# EAGLE schematic Speedy V2.1 (EAGLE 6.6.0)

## Sheet 1 of 4: Power
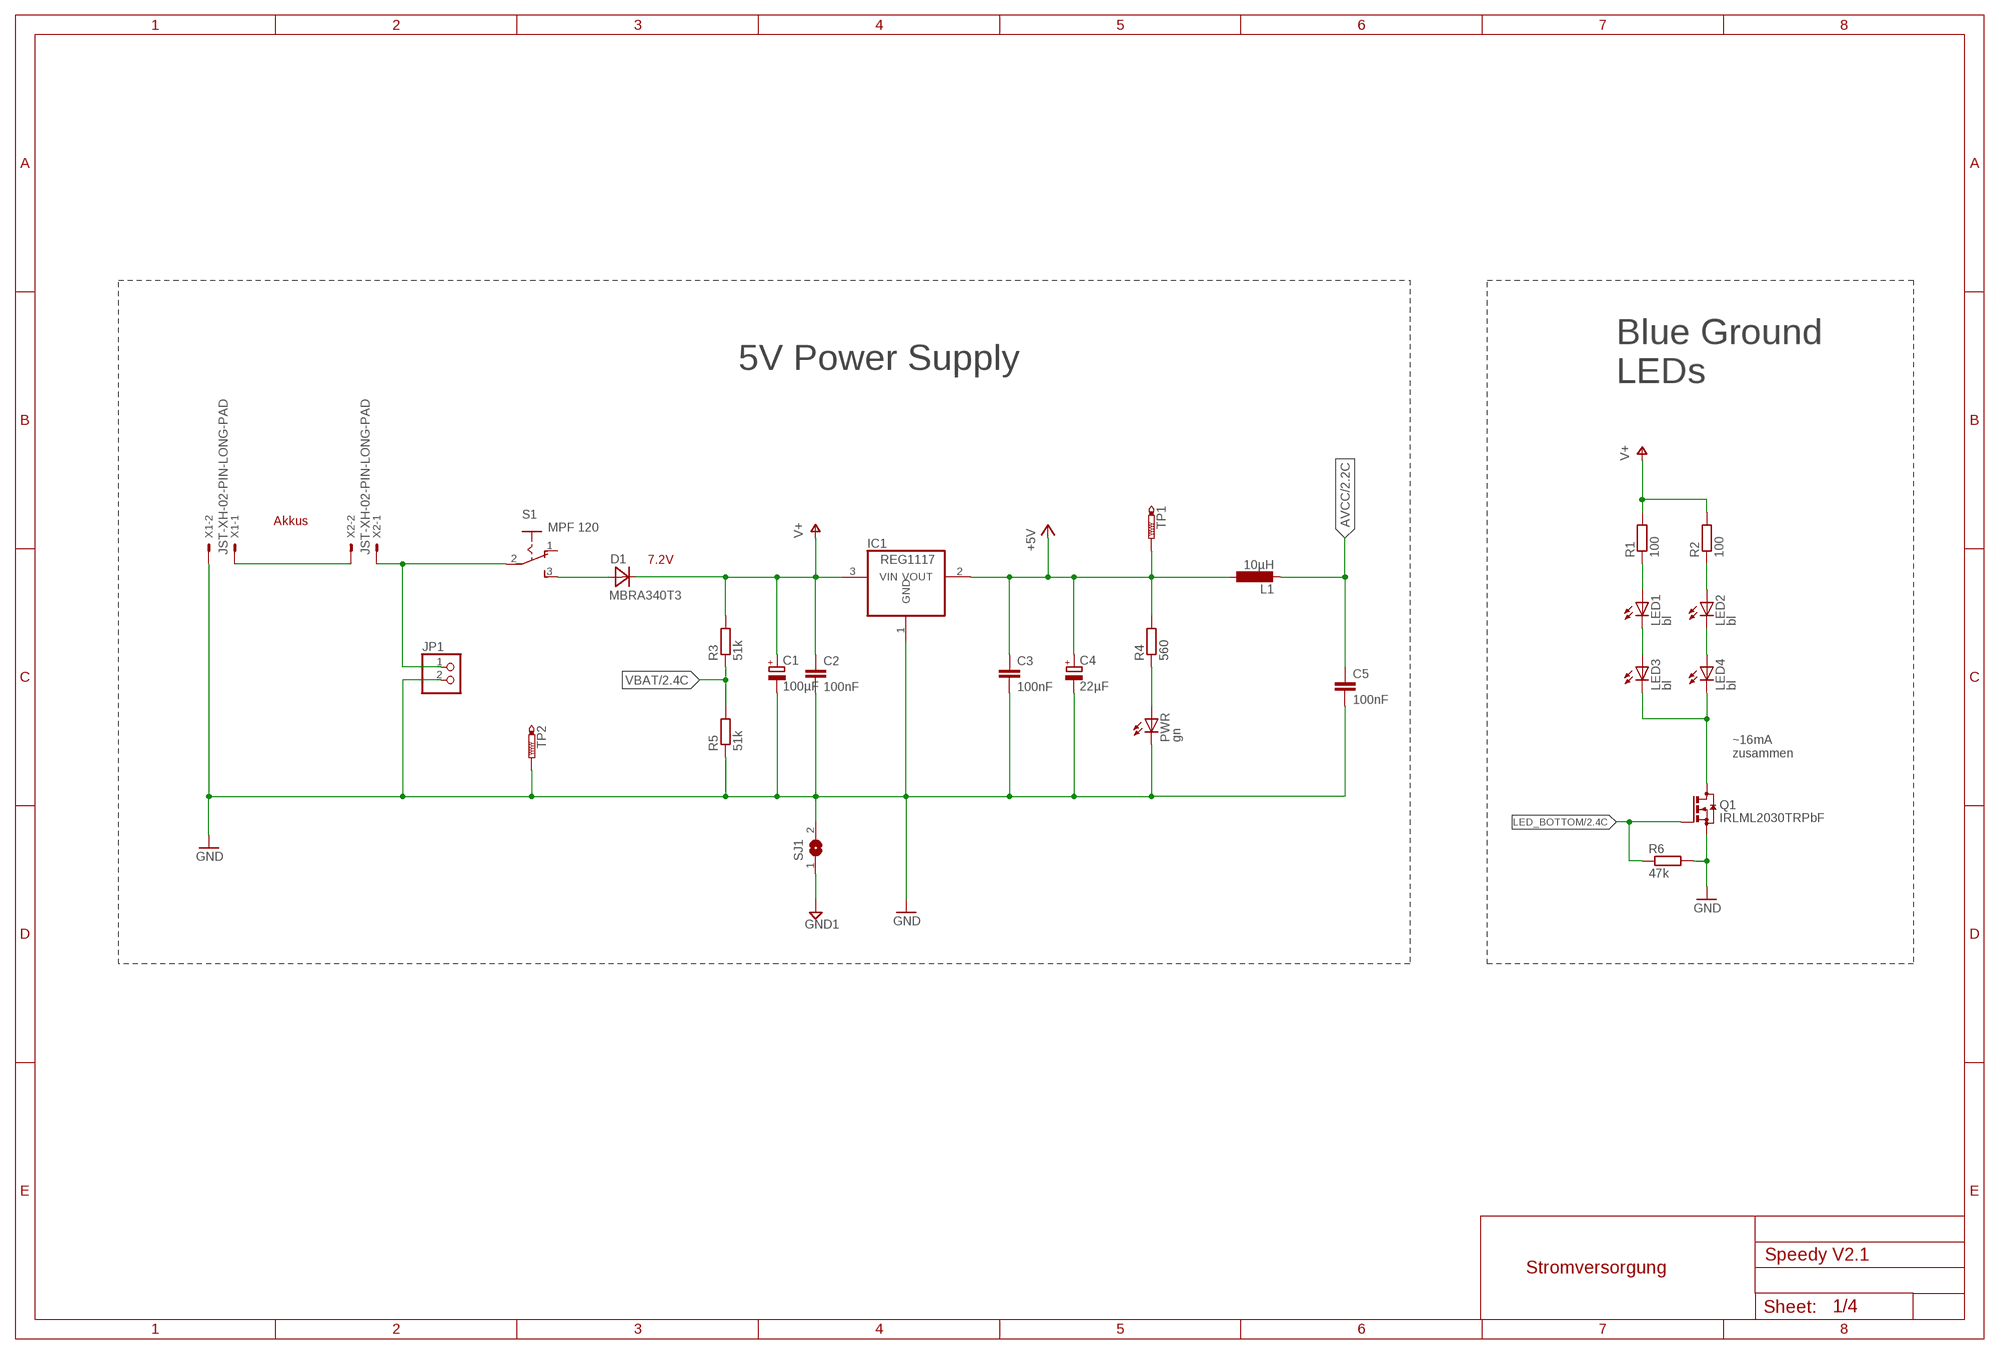
[diagram p0: schematic, sheet 1]

### Parts
C1  100µF  CPOL-EUD  [PANASONIC_D]
C2  100nF  C-EUC0805  [C0805]
C3  100nF  C-EUC0805  [C0805]
C4  22µF  CPOL-EUB  [PANASONIC_B]
C5  100nF  C-EUC0805  [C0805]
D1  MBRA340T3  [SMA]
IC1  REG1117  [SOT223]
JP1  PINHD-1X2  [1X02]
L1  10µH  L-1210  [C1210K]
LED1  bl  LEDCHIPLED_0805  [CHIPLED_0805]
LED2  bl  LEDCHIPLED_0805  [CHIPLED_0805]
LED3  bl  LEDCHIPLED_0805  [CHIPLED_0805]
LED4  bl  LEDCHIPLED_0805  [CHIPLED_0805]
PWR  gn  LEDCHIPLED_0805  [CHIPLED_0805]
Q1  IRLML2030TRPbF  BSS123  [SOT23]
R1  100  R-EU_R0805  [R0805]
R2  100  R-EU_R0805  [R0805]
R3  51k  R-EU_R0805  [R0805]
R4  560  R-EU_R0805  [R0805]
R5  51k  R-EU_R0805  [R0805]
R6  47k  R-EU_R0805  [R0805]
S1  MPF 120  255SB  [255SB]
SJ1  SJ  [SJ]
TP1  PTR1B1,27  [B1,27]
TP2  PTR1PAD1-13  [P1-13]
X1  JST-XH-02-PIN-LONG-PAD  [JST-XH-02-PACKAGE-LONG-PAD]
X2  JST-XH-02-PIN-LONG-PAD  [JST-XH-02-PACKAGE-LONG-PAD]

### Nets
+5V [Supply]: C3.1 C4.+ IC1.2(VOUT) L1.1 R4.2 TP1.TP ; also sheet 2,3,4
AVCC: C5.1 L1.2 ; also sheet 2
GND [Supply]: C1.- C2.2 C3.2 C4.- C5.2 IC1.1(GND) JP1.2 PWR.C Q1.2(S) R5.1 R6.2 SJ1.2 TP2.TP X1.2 ; also sheet 2,3,4
GND1 [Supply]: SJ1.1 ; also sheet 4
LED_BOTTOM: Q1.1(G) R6.1 ; also sheet 2
N$1 [Supply]: X1.1 X2.2
N$3: PWR.A R4.1
N$11: JP1.1 S1.2(P) X2.1
N$13: LED3.C LED4.C Q1.3(D)
N$19: D1.A S1.3(S)
N$29: LED1.A R1.1
N$30: LED1.C LED3.A
N$32: LED2.C LED4.A
N$33: LED2.A R2.1
V+ [Supply]: C1.+ C2.1 D1.C IC1.3(VIN) R1.2 R2.2 R3.2 ; also sheet 2,4
VBAT: R3.1 R5.2 ; also sheet 2
Unconnected: S1.1(O)

### Notes on the sheet
- 5V Power Supply
- Blue Ground 
  LEDs
- Akkus
- 7.2V
- ~16mA
  zusammen
- Stromversorgung

## Sheet 2 of 4: Controller
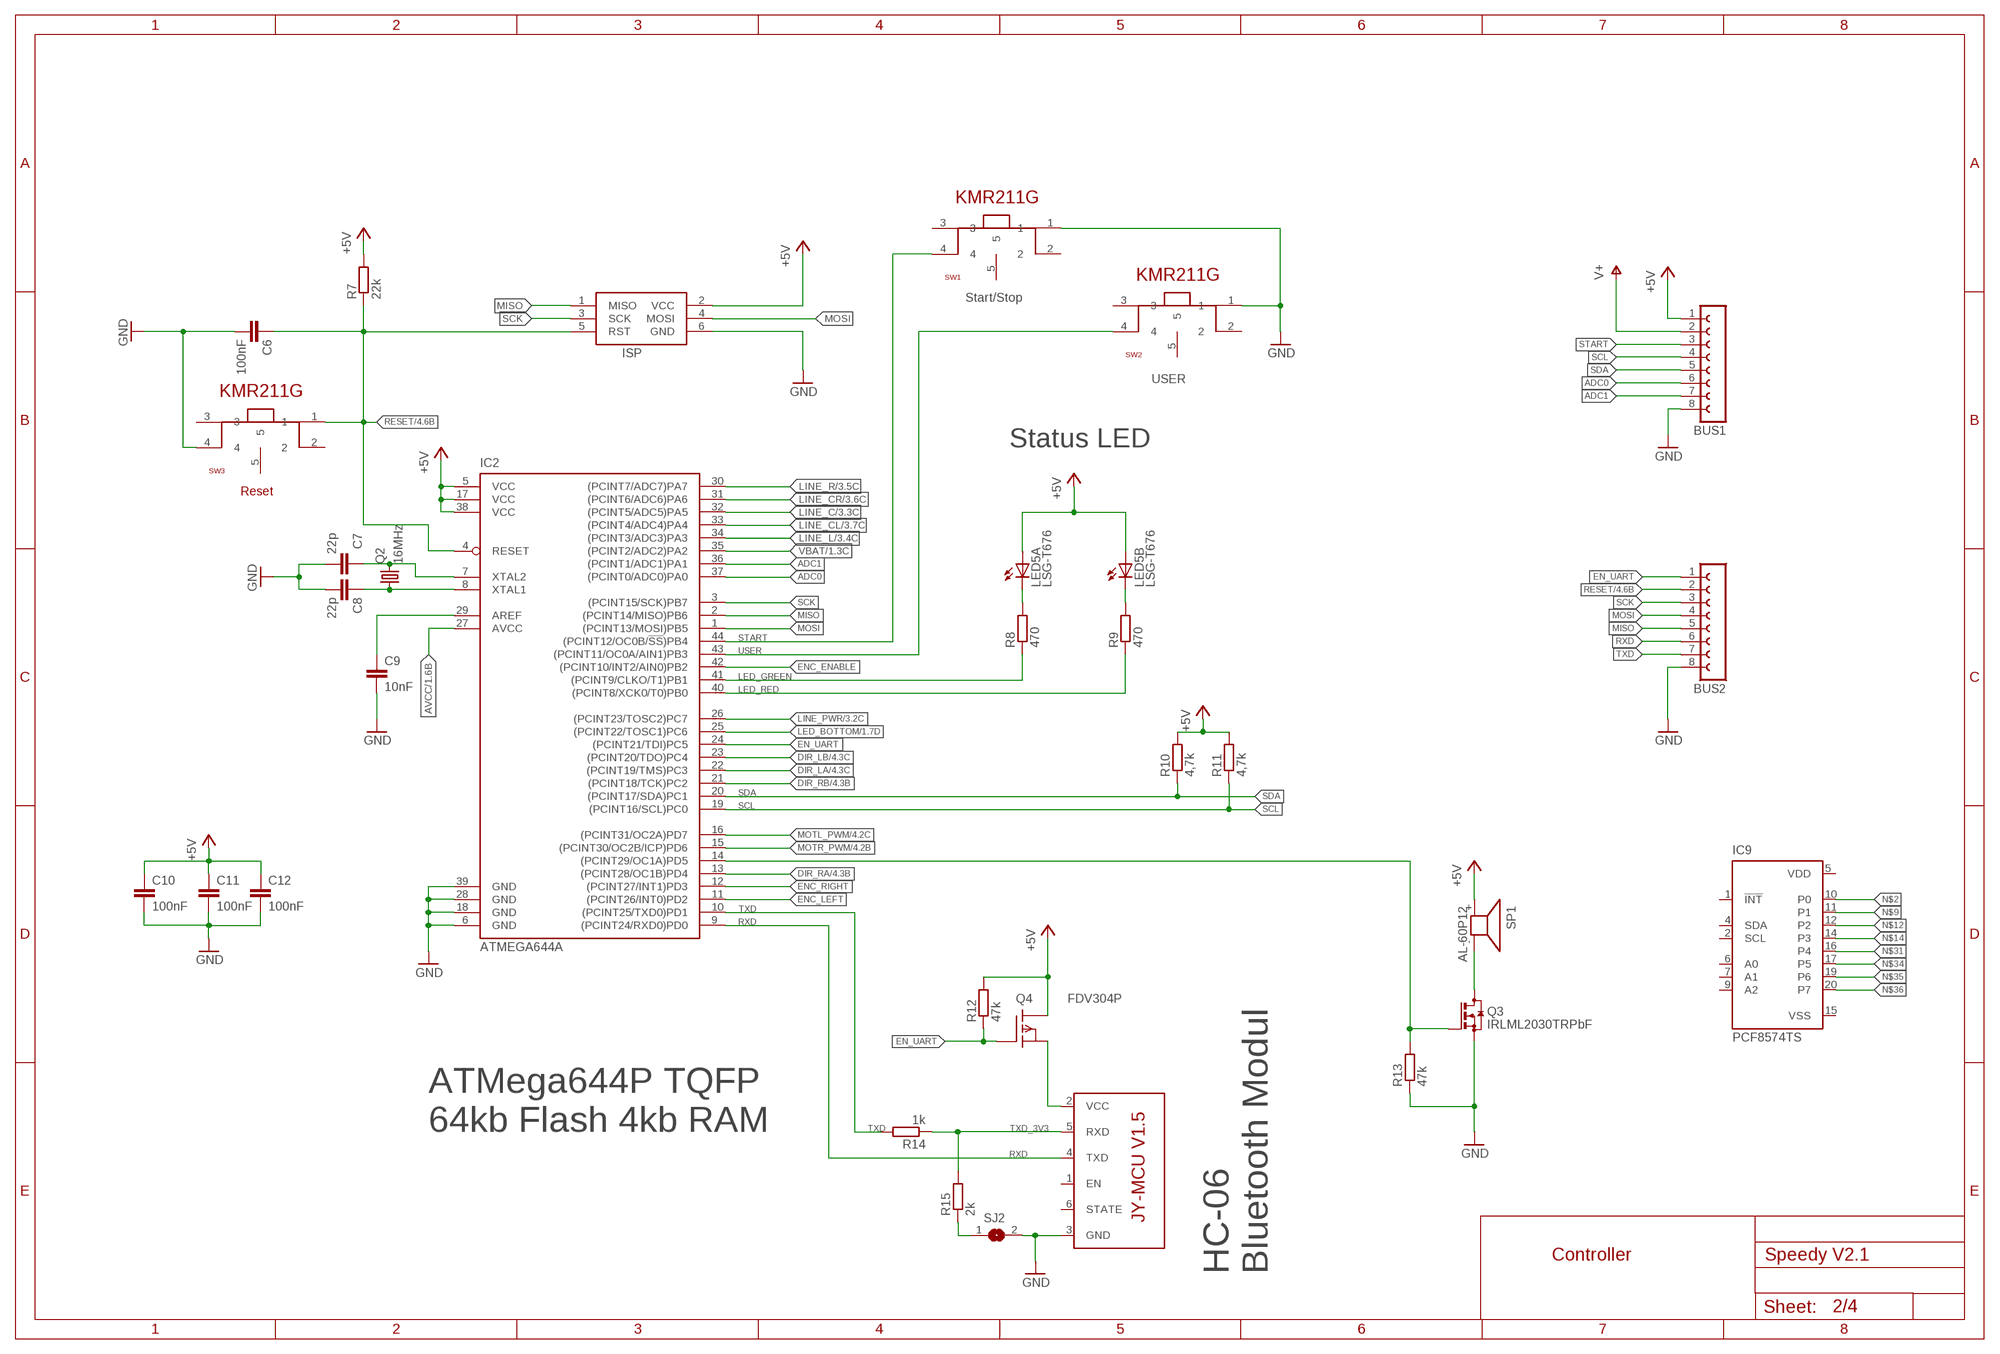
[diagram p1: schematic, sheet 2]

### Parts
BUS1  FE08-1  [FE08]
BUS2  FE08-1  [FE08]
C6  100nF  C-EUC0805  [C0805]
C7  22p  C-EUC0603  [C0603]
C8  22p  C-EUC0603  [C0603]
C9  10nF  C-EUC0603  [C0603]
C10  100nF  C-EUC0603  [C0603]
C11  100nF  C-EUC0603  [C0603]
C12  100nF  C-EUC0603  [C0603]
IC2  ATMEGA644A  [TQFP44]
IC9  PCF8574TS  [SSOP20]
ISP  AVRISP-6  [AVRISP]
LED5  LSG-T676  [P-LCC4-0]
Q2  16MHz  7X5MMMQ  [7X5MMQUARZ]
Q3  IRLML2030TRPbF  BSS123  [SOT23]
Q4  FDV304P  [SOT23]
R7  22k  R-EU_R0805  [R0805]
R8  470  R-EU_R0805  [R0805]
R9  470  R-EU_R0805  [R0805]
R10  4,7k  R-EU_R0805  [R0805]
R11  4,7k  R-EU_R0805  [R0805]
R12  47k  R-EU_R0805  [R0805]
R13  47k  R-EU_R0805  [R0805]
R14  1k  R-EU_R0805  [R0805]
R15  2k  R-EU_R0805  [R0805]
SJ2  SJ  [SJ]
SP1  AL-60P12  KSS1201  [KSS1201]
SW1  KMR211G_SWITCH  [KMR211G_SWITCH]
SW2  KMR211G_SWITCH  [KMR211G_SWITCH]
SW3  KMR211G_SWITCH  [KMR211G_SWITCH]
U1  BT_BOARD  [BT_BOARD]

### Nets
+5V [Supply]: BUS1.1 C10.1 C11.1 C12.1 IC2.5(VCC) IC2.17(VCC) IC2.38(VCC) ISP.2(VCC) LED5.2(A:A) LED5.4(B:A) Q4.D R7.2 R10.2 R11.2 R12.2 SP1.+ ; also sheet 1,3,4
ADC0: BUS1.6 IC2.37((PCINT0/ADC0)PA0)
ADC1: BUS1.7 IC2.36((PCINT1/ADC1)PA1)
AVCC: IC2.27(AVCC) ; also sheet 1
BUZZER: IC2.14((PCINT29/OC1A)PD5) Q3.1(G) R13.2
DIR_LA: IC2.22((PCINT19/TMS)PC3) ; also sheet 4
DIR_LB: IC2.23((PCINT20/TDO)PC4) ; also sheet 4
DIR_RA: IC2.13((PCINT28/OC1B)PD4) ; also sheet 4
DIR_RB: IC2.21((PCINT18/TCK)PC2) ; also sheet 4
EN_UART: BUS2.1 IC2.24((PCINT21/TDI)PC5) Q4.G R12.1
ENC_ENABLE: IC2.42((PCINT10/INT2/AIN0)PB2)
ENC_LEFT: IC2.11((PCINT26/INT0)PD2)
ENC_RIGHT: IC2.12((PCINT27/INT1)PD3)
GND [Supply]: BUS1.8 BUS2.8 C6.2 C7.2 C8.2 C9.2 C10.2 C11.2 C12.2 IC2.6(GND) IC2.18(GND) IC2.28(GND) IC2.39(GND) ISP.6(GND) Q3.2(S) R13.1 SJ2.2 SW1.1 SW2.1 SW3.4 U1.3(GND) ; also sheet 1,3,4
LED_BOTTOM: IC2.25((PCINT22/TOSC1)PC6) ; also sheet 1
LED_GREEN: IC2.41((PCINT9/CLKO/T1)PB1) R8.1
LED_RED: IC2.40((PCINT8/XCK0/T0)PB0) R9.1
LINE_C: IC2.32((PCINT5/ADC5)PA5) ; also sheet 3
LINE_CL: IC2.33((PCINT4/ADC4)PA4) ; also sheet 3
LINE_CR: IC2.31((PCINT6/ADC6)PA6) ; also sheet 3
LINE_L: IC2.34((PCINT3/ADC3)PA3) ; also sheet 3
LINE_PWR: IC2.26((PCINT23/TOSC2)PC7) ; also sheet 3
LINE_R: IC2.30((PCINT7/ADC7)PA7) ; also sheet 3
MISO: BUS2.5 IC2.2((PCINT14/MISO)PB6) ISP.1(MISO)
MOSI: BUS2.4 IC2.1((PCINT13/MOSI)PB5) ISP.4(MOSI)
MOTL_PWM: IC2.16((PCINT31/OC2A)PD7) ; also sheet 4
MOTR_PWM: IC2.15((PCINT30/OC2B/ICP)PD6) ; also sheet 4
N$2: IC9.10(P0)
N$5: Q3.3(D) SP1.-
N$6: LED5.1(A:C) R8.2
N$9: IC9.11(P1)
N$12: IC9.12(P2)
N$14: IC9.14(P3)
N$15: C9.1 IC2.29(AREF)
N$17: R15.1 SJ2.1
N$18: LED5.3(B:C) R9.2
N$20 [Supply]: Q4.S U1.2(VCC)
N$27: C7.1 IC2.7(XTAL2) Q2.P$3
N$28: C8.1 IC2.8(XTAL1) Q2.P$1
N$31: IC9.16(P4)
N$34: IC9.17(P5)
N$35: IC9.19(P6)
N$36: IC9.20(P7)
RESET: BUS2.2 C6.1 IC2.4(RESET) ISP.5(RST) R7.1 SW3.1 ; also sheet 4
RXD: BUS2.6 IC2.9((PCINT24/RXD0)PD0) U1.4(TXD)
SCK: BUS2.3 IC2.3((PCINT15/SCK)PB7) ISP.3(SCK)
SCL: BUS1.4 IC2.19((PCINT16/SCL)PC0) R11.1
SDA: BUS1.5 IC2.20((PCINT17/SDA)PC1) R10.1
START: BUS1.3 IC2.44((PCINT12/OC0B/!SS!)PB4) SW1.4
TXD: BUS2.7 IC2.10((PCINT25/TXD0)PD1) R14.2
TXD_3V3: R14.1 R15.2 U1.5(RXD)
USER: IC2.43((PCINT11/OC0A/AIN1)PB3) SW2.4
V+ [Supply]: BUS1.2 ; also sheet 1,4
VBAT: IC2.35((PCINT2/ADC2)PA2) ; also sheet 1
Unconnected: IC9.1(!INT) IC9.2(SCL) IC9.4(SDA) IC9.6(A0) IC9.7(A1) IC9.9(A2) SW1.2 SW1.3 SW1.5 SW2.2 SW2.3 SW2.5 SW3.2 SW3.3 SW3.5 U1.1(EN) U1.6(STATE)

### Notes on the sheet
- Start/Stop
- USER
- Status LED
- Reset
- ATMega644P TQFP
  64kb Flash 4kb RAM
- Controller
- HC-06
  Bluetooth Modul

## Sheet 3 of 4: Sensors
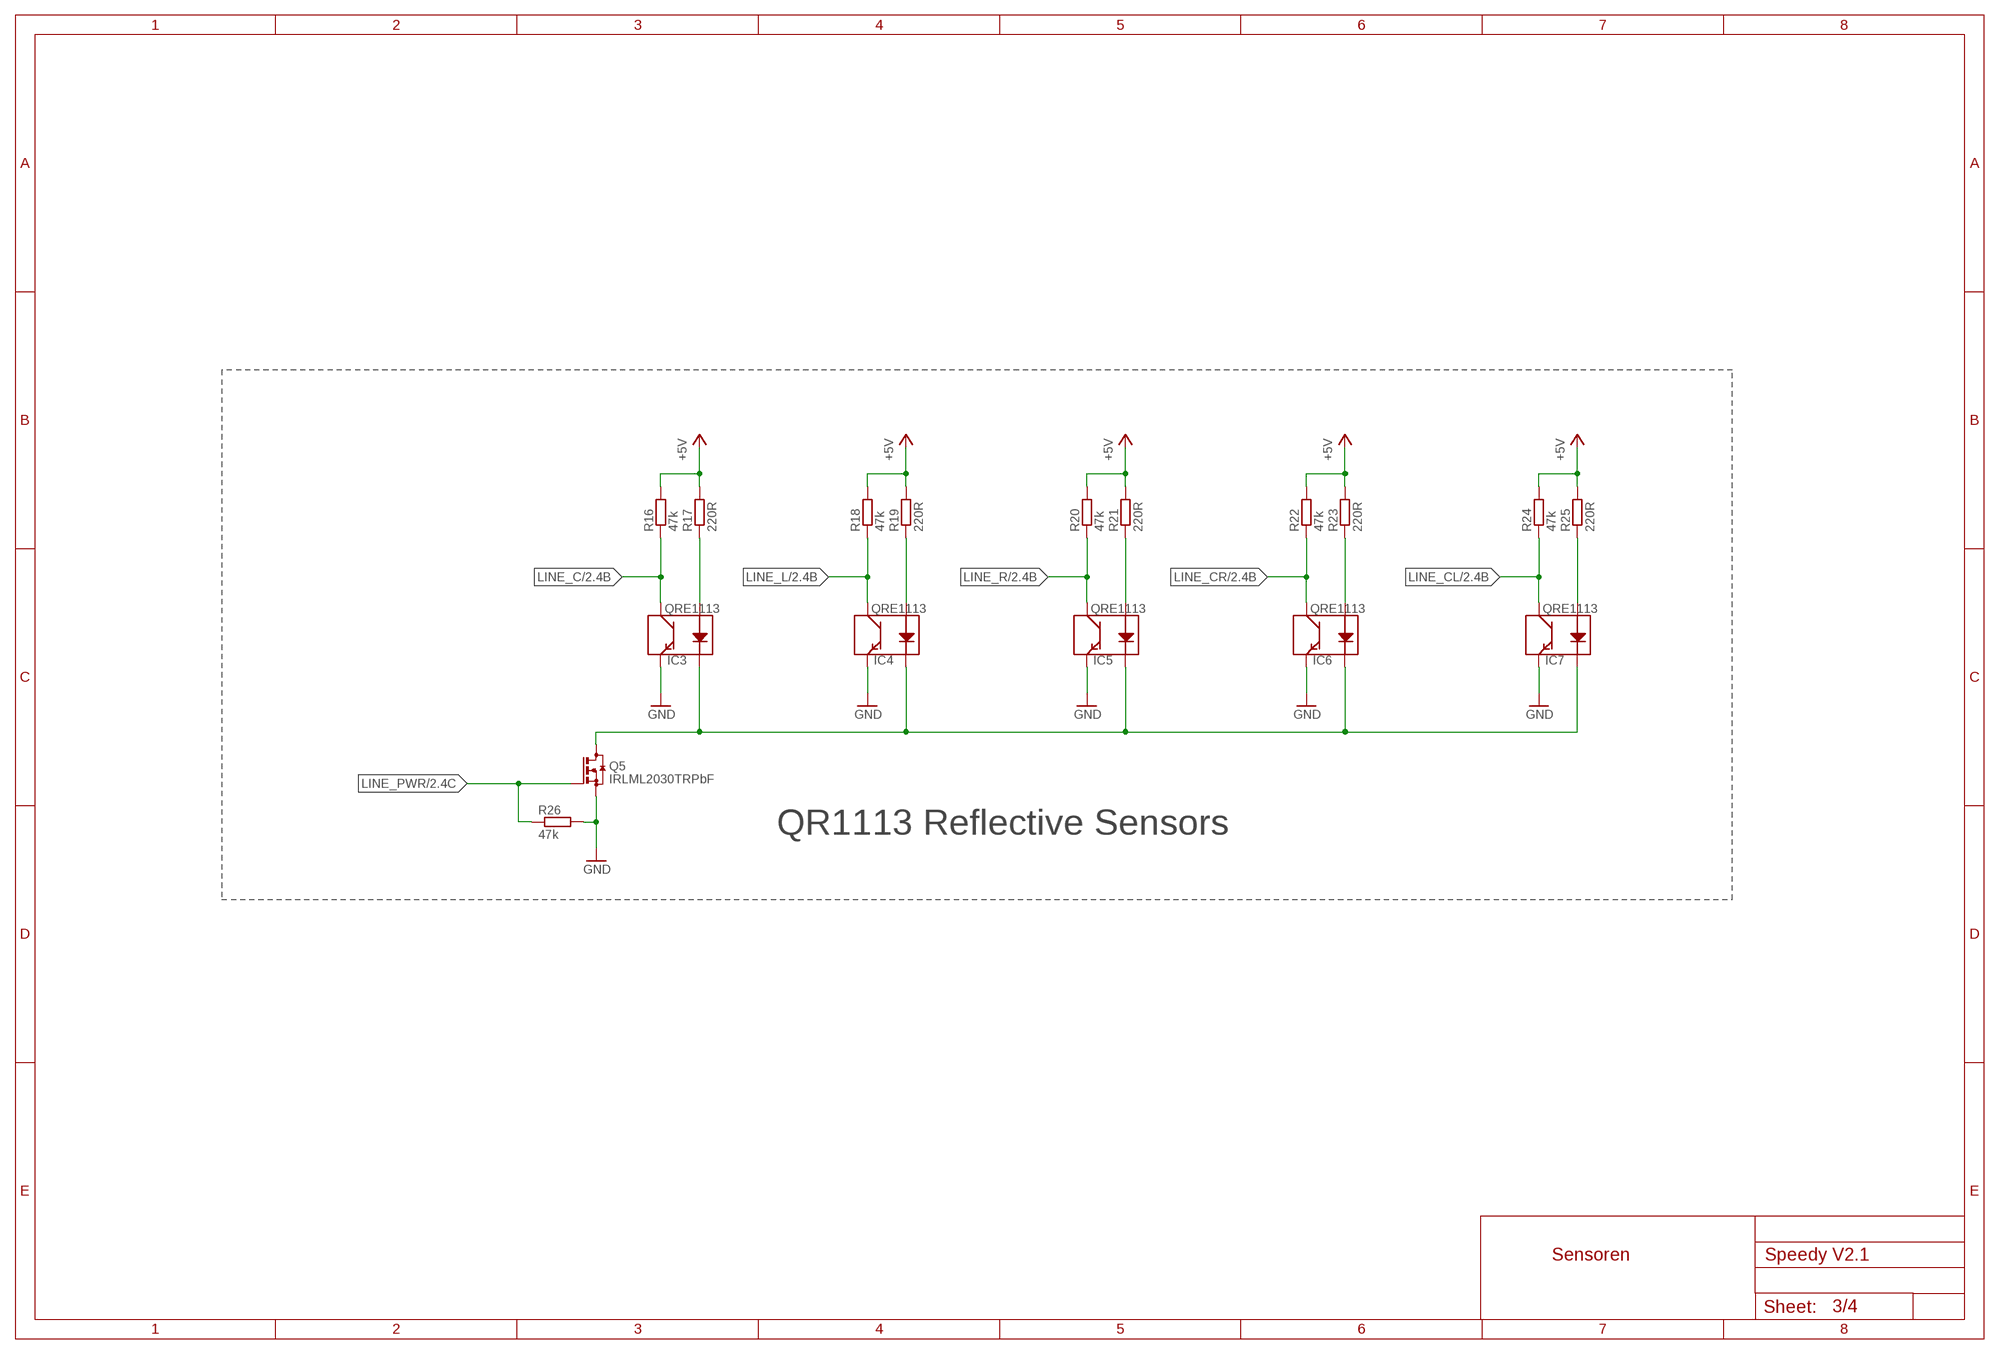
[diagram p2: schematic, sheet 3]

### Parts
IC3  QRE1113  [QRE1113]
IC4  QRE1113  [QRE1113]
IC5  QRE1113  [QRE1113]
IC6  QRE1113  [QRE1113]
IC7  QRE1113  [QRE1113]
Q5  IRLML2030TRPbF  BSS123  [SOT23]
R16  47k  R-EU_R0805  [R0805]
R17  220R  R-EU_R0805  [R0805]
R18  47k  R-EU_R0805  [R0805]
R19  220R  R-EU_R0805  [R0805]
R20  47k  R-EU_R0805  [R0805]
R21  220R  R-EU_R0805  [R0805]
R22  47k  R-EU_R0805  [R0805]
R23  220R  R-EU_R0805  [R0805]
R24  47k  R-EU_R0805  [R0805]
R25  220R  R-EU_R0805  [R0805]
R26  47k  R-EU_R0805  [R0805]

### Nets
+5V [Supply]: R16.2 R17.2 R18.2 R19.2 R20.2 R21.2 R22.2 R23.2 R24.2 R25.2 ; also sheet 1,2,4
GND [Supply]: IC3.4(E) IC4.4(E) IC5.4(E) IC6.4(E) IC7.4(E) Q5.2(S) R26.2 ; also sheet 1,2,4
LINE_C: IC3.3(C) R16.1 ; also sheet 2
LINE_CL: IC7.3(C) R24.1 ; also sheet 2
LINE_CR: IC6.3(C) R22.1 ; also sheet 2
LINE_L: IC4.3(C) R18.1 ; also sheet 2
LINE_PWR: Q5.1(G) R26.1 ; also sheet 2
LINE_R: IC5.3(C) R20.1 ; also sheet 2
N$4: IC3.2(K) IC4.2(K) IC5.2(K) IC6.2(K) IC7.2(K) Q5.3(D)
N$10: IC4.1(A) R19.1
N$37: IC3.1(A) R17.1
N$40: IC5.1(A) R21.1
N$42: IC6.1(A) R23.1
N$43: IC7.1(A) R25.1

### Notes on the sheet
- QR1113 Reflective Sensors
- Sensoren

## Sheet 4 of 4: Motors
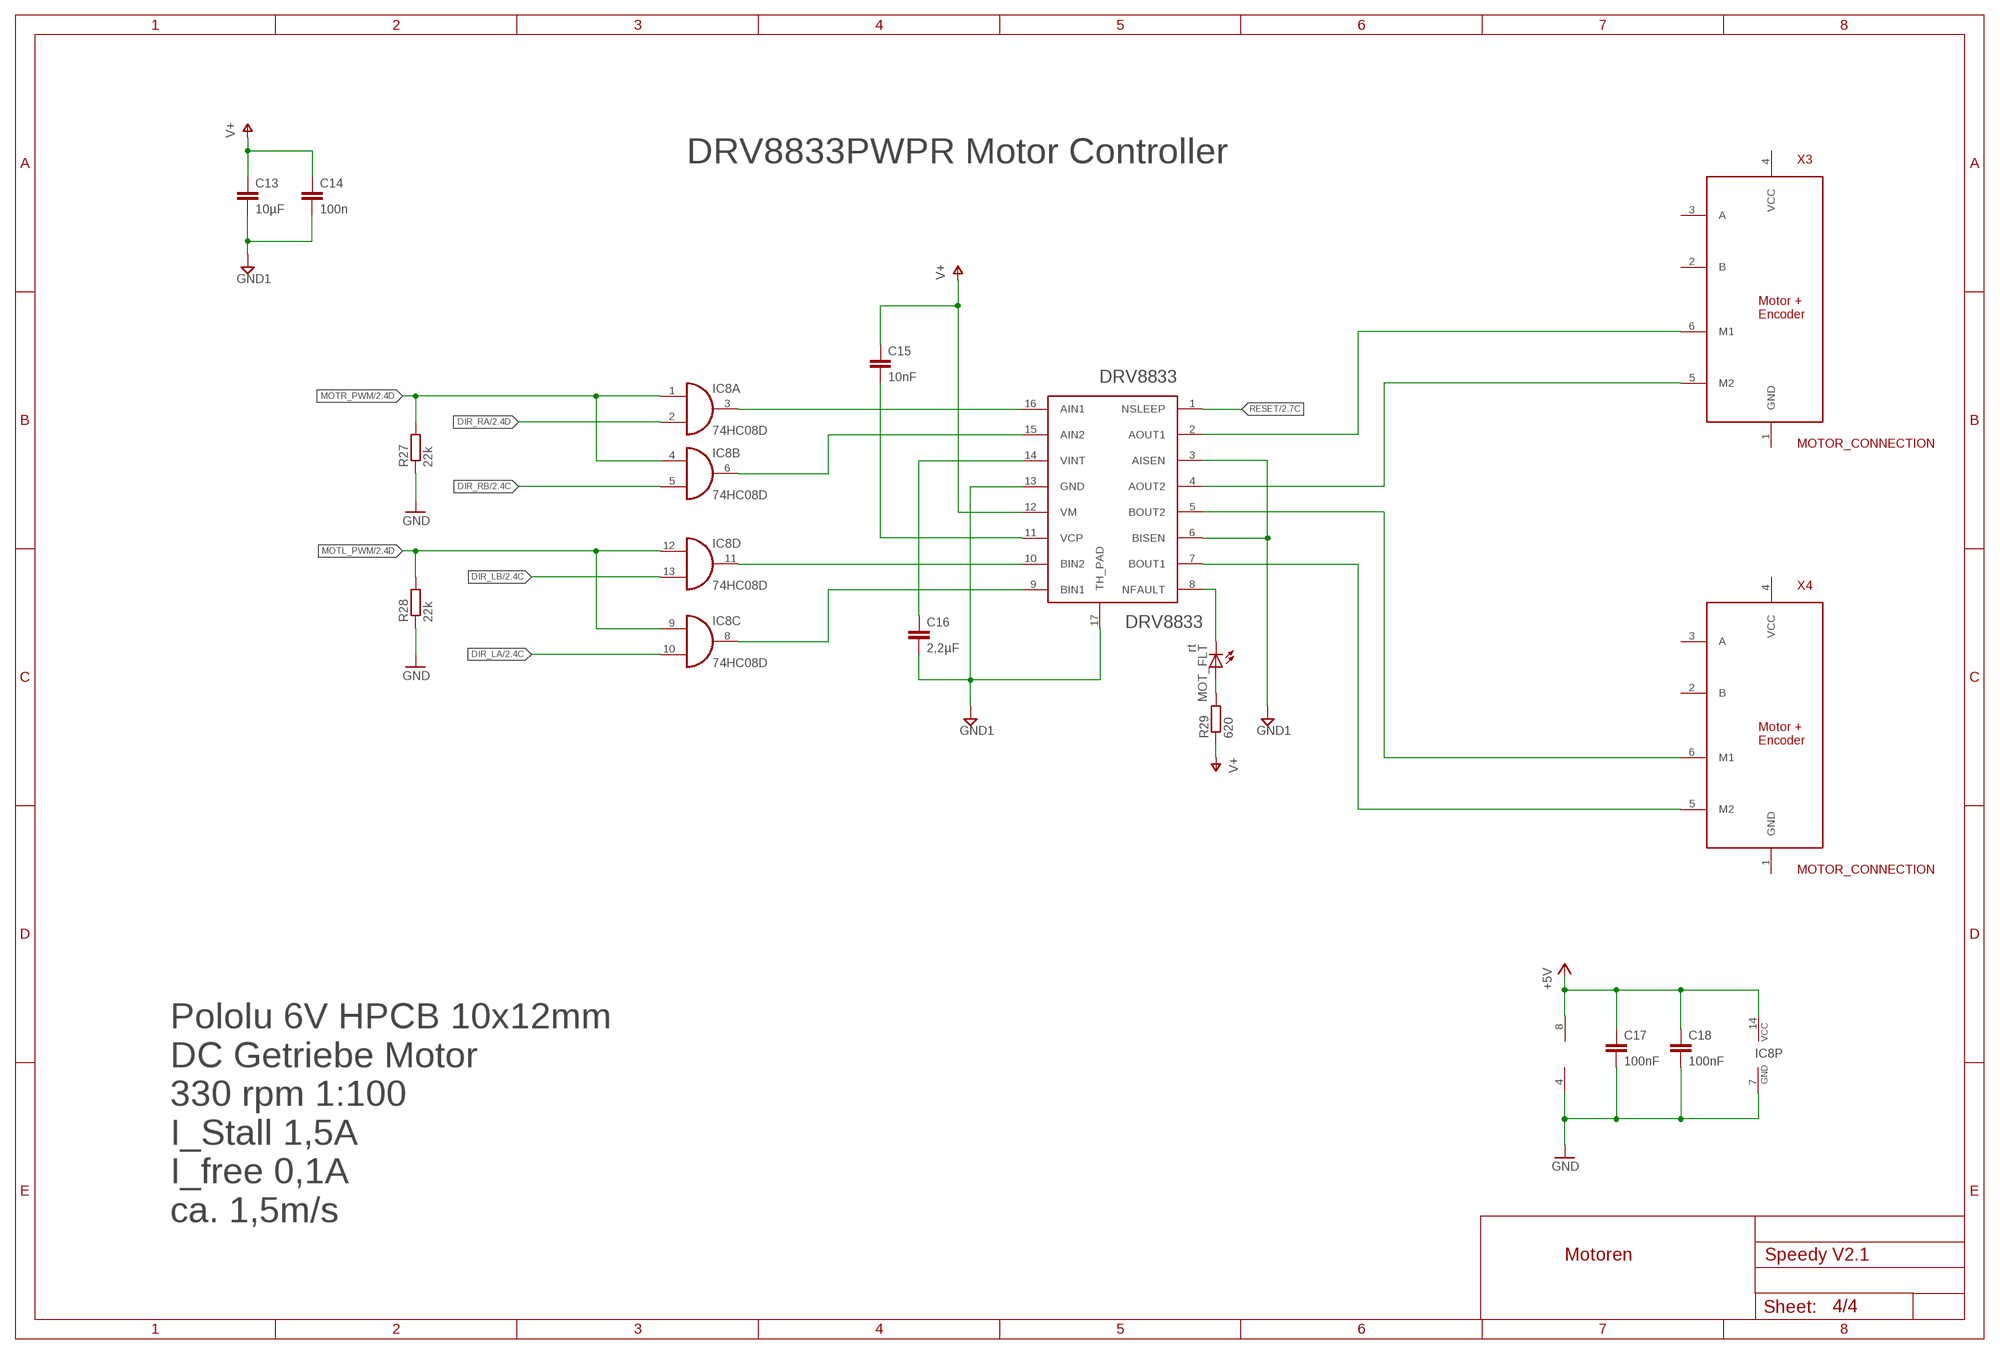
[diagram p3: schematic, sheet 4]

### Parts
C13  10µF  C-EUC1206  [C1206]
C14  100n  C-EUC0805  [C0805]
C15  10nF  C-EUC0805  [C0805]
C16  2,2µF  C-EUC1206  [C1206]
C17  100nF  C-EUC0805  [C0805]
C18  100nF  C-EUC0805  [C0805]
IC8  74HC08D  [SO14]
IC11  LM358D  [SO08]
MOT_FLT  rt  LEDCHIP-LED0805  [CHIP-LED0805]
R27  22k  R-EU_R0805  [R0805]
R28  22k  R-EU_R0805  [R0805]
R29  620  R-EU_R0805  [R0805]
U3  DRV8833  [SOP65P640X120-17N]
X3  MOTOR_CONNECTION  [2X03]
X4  MOTOR_CONNECTION  [2X03]

### Nets
+5V [Supply]: C17.1 C18.1 IC8.14(P:VCC) IC11.8(P:V+) ; also sheet 1,2,3
DIR_LA: IC8.10(C:I1) ; also sheet 2
DIR_LB: IC8.13(D:I1) ; also sheet 2
DIR_RA: IC8.2(A:I1) ; also sheet 2
DIR_RB: IC8.5(B:I1) ; also sheet 2
GND [Supply]: C17.2 C18.2 IC8.7(P:GND) IC11.4(P:V-) R27.1 R28.1 ; also sheet 1,2,3
GND1 [Supply]: C13.2 C14.2 C16.2 U3.3(AISEN) U3.6(BISEN) U3.13(GND) U3.17(TH_PAD) ; also sheet 1
MOTL_PWM: IC8.9(C:I0) IC8.12(D:I0) R28.2 ; also sheet 2
MOTR_PWM: IC8.1(A:I0) IC8.4(B:I0) R27.2 ; also sheet 2
N$7: C16.1 U3.14(VINT)
N$8: C15.2 U3.11(VCP)
N$16: U3.5(BOUT2) X4.6(M1)
N$21: MOT_FLT.A R29.2
N$22: MOT_FLT.C U3.8(NFAULT)
N$23: IC8.3(A:O) U3.16(AIN1)
N$24: IC8.6(B:O) U3.15(AIN2)
N$25: IC8.11(D:O) U3.10(BIN2)
N$26: IC8.8(C:O) U3.9(BIN1)
N$38: U3.7(BOUT1) X4.5(M2)
N$39: U3.4(AOUT2) X3.5(M2)
N$41: U3.2(AOUT1) X3.6(M1)
RESET: U3.1(NSLEEP) ; also sheet 2
V+ [Supply]: C13.1 C14.1 C15.1 R29.1 U3.12(VM) ; also sheet 1,2
Unconnected: IC11.1(A:OUT) IC11.2(A:-IN) IC11.3(A:+IN) IC11.5(B:+IN) IC11.6(B:-IN) IC11.7(B:OUT) X3.1(GND) X3.2(B) X3.3(A) X3.4(VCC) X4.1(GND) X4.2(B) X4.3(A) X4.4(VCC)

### Notes on the sheet
- DRV8833PWPR Motor Controller
- Pololu 6V HPCB 10x12mm 
  DC Getriebe Motor
  330 rpm 1:100
  I_Stall 1,5A
  I_free 0,1A
  ca. 1,5m/s
- Motoren

## Power pins joined to a net without a drawn wire
VDD: IC9.5(VDD)
VSS: IC9.15(VSS)

## Library data of the parts
BUS1 BUS2 = con-lsta:FE08-1: FEMALE HEADER; OC_FARNELL: unknown; OC_NEWARK: unknown
C1 C4 = rcl:CPOL-EU: POLARIZED CAPACITOR, European symbol
C2 C3 C5-C18 = rcl:C-EU: CAPACITOR, European symbol
D1 = diode:MBRA340T3: Surface Mount Schottky Power Rectifier Source: http://www.onsemi.com/pub_link/Collateral/MBRA340T3-D.PDF
IC1 = burr-brown:REG1117: 800mA and 1A Low Dropout (LDO) Positive Regulator 1.8V, 2.5V, 2.85V, 3.3V, 5V, and Adj; MPN: REG1117; OC_FARNELL: 1097566; OC_NEWARK: 14P6981
IC2 = atmel:ATMEGA644: 8-bit Microcontroller with 64K Bytes In-System Programmable Flash Source: http://www.atmel.com/dyn/resources/prod_documents/doc2593.pdf; MPN: ATMEGA644PV-10AU; OC_FARNELL: 1455123; OC_NEWARK: 58M3748
IC3-IC7 = Testing:QRE1113
IC8 = 74xx-eu:74*08: Quad 2-input AND gate
IC9 = micro-philips:PCF8574: I2C-Bus Remote 8-bit I/O expander http://www.semiconductors.philips.com/acrobat_download/datasheets/PCF8574_4.pdf; MPN: PCF8574TS/3,118; OC_FARNELL: 1506644; OC_NEWARK: 70R6873
IC11 = linear:LM358: OP AMP also LM158; LM258; LM2904 Source: http://cache.national.com/ds/LM/LM158.pdf
ISP = adafruit:AVRISP: AVR ISP HEADER Standard 6 pin header for AVR programming
JP1 = pinhead:PINHD-1X2: PIN HEADER
L1 = Induktor-1210:L-1210
LED1-LED4 MOT_FLT PWR = led:LED: LED OSRAM: - CHIPLED LG R971, LG N971, LY N971, LG Q971, LY Q971, LO R971, LY R971 LH N974, LH R974 LS Q976, LO Q976, LY Q976 LO Q996 - Hyper CHIPLED LW Q18S LB Q993, LB Q99A, LB R99A - SideLED LS A670, LO A670, LY A670, LG A670, LP A670 LB A673, LV A673, LT A673, LW A673 LH A674 LY A675 LS A676, LA A676, LO A676, LY A676, LW A676 LS A679, LY A679, LG A679 - Hyper Micro SIDELED® LS Y876, LA Y876, LO Y876, LY Y876 LT Y87S - SmartLED LW L88C, LW L88S LB L89C, LB L89S, LG L890 LS L89K, LO L89K, LY L89K LS L896, LA L896, LO L896, LY L896 - TOPLED LS T670, LO T670, LY T670, LG T670, LP T670 LSG T670, LSP T670, LSY T670, LOP T670, LYG T670 LG T671, LOG T671, LSG T671 LB T673, LV T673, LT T673, LW T673 LH T674 LS T676, LA T676, LO T676, LY T676, LB T676, LH T676, LSB T676, LW T676 LB T67C, LV T67C, LT T67C, LS T67K, LO T67K, LY T67K, LW E67C LS E67B, LA E67B, LO E67B, LY E67B, LB E67C, LV E67C, LT E67C LW T67C LS T679, LY T679, LG T679 LS T770, LO T770, LY T770, LG T770, LP T770 LB T773, LV T773, LT T773, LW T773 LH T774 LS E675, LA E675, LY E675, LS T675 LS T776, LA T776, LO T776, LY T776, LB T776 LHGB T686 LT T68C, LB T68C - Hyper Mini TOPLED® LB M676 - Mini TOPLED Santana® LG M470 LS M47K, LO M47K, LY M47K Source: http://www.osram.convergy.de LUXEON: - LUMILED® LXK2-PW12-R00, LXK2-PW12-S00, LXK2-PW14-U00, LXK2-PW14-V00 LXK2-PM12-R00, LXK2-PM12-S00, LXK2-PM14-U00 LXK2-PE12-Q00, LXK2-PE12-R00, LXK2-PE12-S00, LXK2-PE14-T00, LXK2-PE14-U00 LXK2-PB12-K00, LXK2-PB12-L00, LXK2-PB12-M00, LXK2-PB14-N00, LXK2-PB14-P00, LXK2-PB14-Q00 LXK2-PR12-L00, LXK2-PR12-M00, LXK2-PR14-Q00, LXK2-PR14-R00 LXK2-PD12-Q00, LXK2-PD12-R00, LXK2-PD12-S00 LXK2-PH12-R00, LXK2-PH12-S00 LXK2-PL12-P00, LXK2-PL12-Q00, LXK2-PL12-R00 Source: www.luxeon.com KINGBRIGHT: KA-3528ASYC Source: www.kingbright.com
LED5 = led:LSG-T676: LSG T676 Hyper Multi TOPLED ® Hyper-Bright LED Source: http://docs-europe.electrocomponents.com/webdocs/08c3/0900766b808c36ca.pdf
Q1 Q3 Q5 = transistor-small-signal:BSS123: N-CHANNEL MOS FET
Q2 = Quarz-SMD:7X5MMMQ
Q4 = MOSFET-PChannel:FDV304P
R1-R29 = rcl:R-EU_: RESISTOR, European symbol
S1 = switch:255SB: SLIDING SWITCH Distributor Buerklin, 11G810
SJ1 SJ2 = jumper:SJ: SMD solder JUMPER
SP1 = buzzer:KSS1201: SPEAKER Source: Schukat; OC_FARNELL: unknown; OC_NEWARK: unknown
SW1-SW3 = KMR211G_SWITCH:KMR211G_SWITCH
TP1 TP2 = testpad:PTR1: TEST PIN
U1 = BT-Board_JY-MCU V1.3:BT_BOARD
U3 = DRV8833PWP:DRV8833
X1 X2 = Rembrandt Electronics - JST XH Connectors v1-0:JST-XH-02-PIN: JST XH Connector 2 Pin Wire to board connector. Pitch: 2,54 mm, (0.100") Number of pins: 2 Created by Rembrandt Electronics www.rembrandtelectronics.com
X3 X4 = Pololu Motor mount ENC:MOTOR_CONNECTION

## Net classes
1 Supply: width 0.3 mm